# Altium schematic sheet EIT_Teensy_PSU.SchDoc
size A4
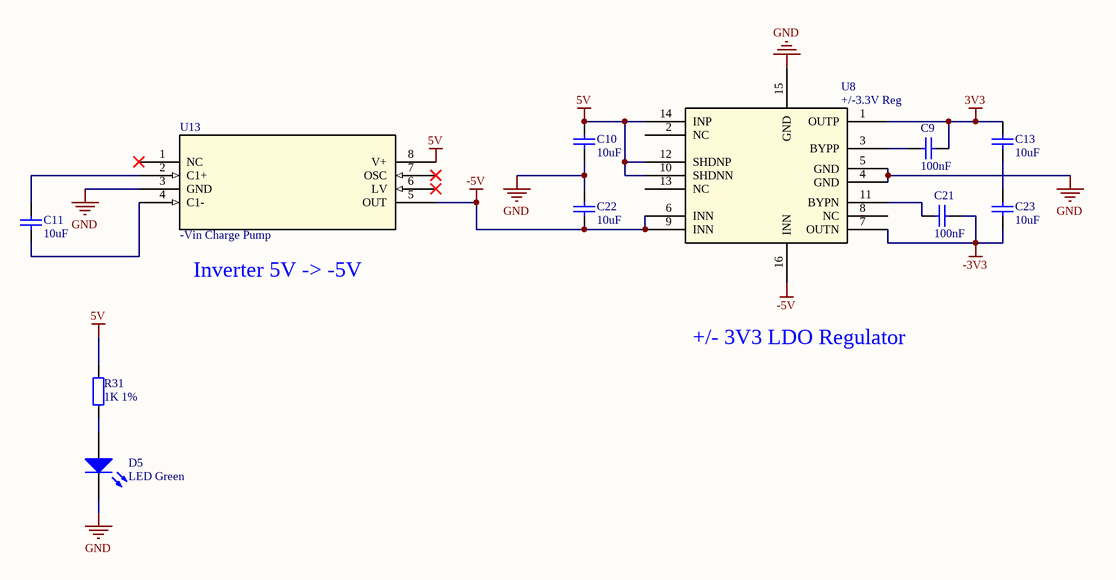
[diagram p0: EIT_Teensy_PSU.SchDoc]

## Parts
C9  100nF  [0603 CAP]
C10  10uF  [0603 CAP]
C11  10uF  [0603 CAP]
C13  10uF  [0603 CAP]
C21  100nF  [0603 CAP]
C22  10uF  [0603 CAP]
C23  10uF  [0603 CAP]
D5  LED Green  [0603 LED]
R31  1K 1%  [0603 RES]
U8  +/-3.3V Reg  [14-DFN]
U13  -Vin Charge Pump  [8-SOIC]

## Nets
3V3: C9.2 C13.2 U8.1(OUTP)
5V: C10.2 R31.1 U8.10(SHDNN) U8.12(SHDNP) U8.14(INP) U13.8(V+)
-3V3: C21.2 C23.1 U8.7(OUTN)
-5V: C22.1 U8.6(INN) U8.9(INN) U8.16(INN) U13.5(OUT)
GND: C10.1 C22.2 D5.2(K) U8.4(GND) U8.5(GND) U8.15(GND) U13.3(GND)
NetC9_1: C9.1 U8.3(BYPP)
NetC11_1: C11.1 U13.4(C1-)
NetC11_2: C11.2 U13.2(C1+)
NetC13_1: C13.1 C23.2
NetC21_1: C21.1 U8.11(BYPN)
NetD5_1: D5.1(A) R31.2

Not connected (* = marked no-connect by the designer): U8 2(NC) 8(NC) 13(NC); U13 1(NC)* 6(LV)* 7(OSC)*

## Notes on the sheet
- Inverter 5V -> -5V
- +/- 3V3 LDO Regulator

## Library data of the parts
C9 C21 = Cap 0603 100nF 10% 50V: Multi Layer Ceramic Capacitor (MLCC) / Cap Ceramic 0.1uF 50V X7R 10% Pad SMD 0603 125¡ãC T/R; Manufacturer: Samsung; Manufacturer Part Number: CL10B104KB8NNNC; Supplier 1: Digi-Key; RoHS: Yes; Category: Ceramic Capacitors; Stock 1: 16768569; Pricing 1: 1=0.10000, 10=0.03000, 50=0.01620, 100=0.01330, 500=0.00950, 1000=0.00746 (USD); Mount: Surface Mount; Case/Package: 0603; Case Code (Metric): 1608; Case Code (Imperial): 0603; Material: Ceramic; Contact Plating: Tin; Min Operating Temperature: -55°C; Max Operating Temperature: 125°C; Tolerance: 10%; Package Quantity: 1; Packaging: Tape and Reel; Capacitance: 100nF; Dielectric: X7R; Series: CL; Voltage Rating: 50V; Voltage: 50V; Voltage Rating (DC): 50V; Construction: Flat; Length: 1.6mm; Width: 0.031inch; Height: 0.8mm; Depth: 0.8mm; Thickness: 0.035inch; Radiation Hardening: No; Lead Free: Lead Free; RoHS Compliant: Yes; ComponentLink1URL: https://datasheet.ciiva.com/25803/cl10b104kb8nnnc-25803393.pdf?src-supplier=Digi-Key; ComponentLink1Description: https://datasheet.ciiva.com/25803/cl10b104kb8nnnc-25803393.pdf?src-supplier=Digi-Key; ComponentLink2URL: https://datasheet.ciiva.com/26838/getdatasheetpartid-89097-26838411.pdf?src-supplier=Verical; ComponentLink2Description: https://datasheet.ciiva.com/26838/getdatasheetpartid-89097-26838411.pdf?src-supplier=Verical; ComponentLink3URL: https://datasheet.ciiva.com/29198/456651-da-01-en-vs-kondensator-0605-29198839.pdf?src-supplier=Conrad; ComponentLink3Description: https://datasheet.ciiva.com/29198/456651-da-01-en-vs-kondensator-0605-29198839.pdf?src-supplier=Conrad; Supplier Part Number 1: 1276-1000-1-ND
C10 C11 C13 C22 C23 = Cap 0603 10uF 10% 25V: 0603 10 uF 25 V ±20 % Tolerance X5R Surface Mount Multilayer Ceramic Capacitor; Manufacturer: Murata; Manufacturer Part Number: GRT188R61E106ME13D; Voltage Rating: 25V; Tolerance: 20%; Supplier 1: Digi-Key; RoHS: No; Category: Ceramic Capacitors; Stock 1: 290939; Pricing 1: 1=0.53000, 10=0.36700, 50=0.25660, 100=0.22000, 500=0.16498, 1000=0.13932 (USD); Case/Package: 0603; RoHS Compliant: No; ComponentLink1URL: https://search.murata.co.jp/Ceramy/image/img/A01X/G101/ENG/GRT188R61E106ME13-01.pdf?src-supplier=Digi-Key; ComponentLink1Description: https://search.murata.co.jp/Ceramy/image/img/A01X/G101/ENG/GRT188R61E106ME13-01.pdf?src-supplier=Digi-Key; Supplier Part Number 1: 490-12323-1-ND; Mount: Surface Mount; Case Code (Metric): 1608; Case Code (Imperial): 0603; Min Operating Temperature: -55°C; Max Operating Temperature: 85°C; Packaging: Tape and Reel; Capacitance: 10uF; Length: 0.063inch; Width: 0.031inch; Thickness: 0.035inch; Ratings: AEC-Q200; ComponentLink2URL: http://search.murata.co.jp/Ceramy/image/img/A01X/G101/ENG/GRT188R61E106ME13-01.pdf?src-supplier=Digi-Key; ComponentLink2Description: http://search.murata.co.jp/Ceramy/image/img/A01X/G101/ENG/GRT188R61E106ME13-01.pdf?src-supplier=Digi-Key
D5 = LED Green 0603 2V: LED GREEN DIFFUSED 0603 SMD; Manufacturer: Osram Opto; Manufacturer Part Number: LG Q396-PS-35; Lens Color: White; Luminous Intensity: 163mcd; Test Current: 20mA; Viewing Angle: 120°; Dominant Wavelength: 573nm; Forward Voltage: 2V; Lens Style: Flat,Rectangular; Lens Size: 0.8mm; Supplier 1: Digi-Key; RoHS: Yes; Stock 1: 58559; Pricing 1: 1=0.38000, 10=0.20600, 100=0.09540, 500=0.08808, 1000=0.06900, 2000=0.06754 (USD); Mount: Surface Mount; Case/Package: 0603; Color: Green; Case Code (Imperial): 0603; Case Code (Metric): 1608; Packaging: Tape and Reel; Lens Transparency: Diffused; Forward Current: 20mA; Wavelength: 573nm; Length: 1.6mm; Width: 0.8mm; Height: 0.4mm; RoHS Compliant: Yes; REACH SVHC: No SVHC; ComponentLink1URL: http://www.farnell.com/datasheets/2057314.pdf?src-supplier=Farnell; ComponentLink1Description: http://www.farnell.com/datasheets/2057314.pdf?src-supplier=Farnell; ComponentLink2URL: https://dammedia.osram.info/media/resource/hires/osram-dam-2493948/LG%20Q396.pdf?src-supplier=Digi-Key; ComponentLink2Description: https://dammedia.osram.info/media/resource/hires/osram-dam-2493948/LG%20Q396.pdf?src-supplier=Digi-Key; ComponentLink3URL: http://www.osram-os.com/Graphics/XPic6/00153197_0.pdf?src-supplier=Digi-Key; ComponentLink3Description: http://www.osram-os.com/Graphics/XPic6/00153197_0.pdf?src-supplier=Digi-Key; ComponentLink4URL: http://www.farnell.com/datasheets/2057314.pdf?src-supplier=Element14; ComponentLink4Description: http://www.farnell.com/datasheets/2057314.pdf?src-supplier=Element14; ComponentLink5URL: http://www.farnell.com/datasheets/2057314.pdf?src-supplier=Newark; ComponentLink5Description: http://www.farnell.com/datasheets/2057314.pdf?src-supplier=Newark; Supplier Part Number 1: 475-3754-1-ND
R31 = Res 0603 1K 1%: RES SMD 1K OHM 1% 1/10W 0603; Manufacturer: Yageo; Manufacturer Part Number: RC0603FR-071KL; Power Rating: 100mW; Resistance: 1kR; Voltage Rating: 50V; Temperature Coefficient: 100ppm/°C; Supplier 1: Digi-Key; RoHS: Yes; Category: Chip SMD Resistors; Stock 1: 23578085; Pricing 1: 1=0.10000, 10=0.02400, 100=0.00970, 1000=0.00436, 2500=0.00378 (USD); Case/Package: 0603; Case Code (Imperial): 0603; Case Code (Metric): 1608; Size Code: 0603; Contact Plating: Tin,Matte; Min Operating Temperature: -55°C; Max Operating Temperature: 155°C; Tolerance: 1%; Packaging: Tape and Reel; Termination: SMD/SMT; Resistor Type: Thick Film; Features: Moisture Resistant; Series: RC; Max Power Dissipation: 100mW; Number of Terminations: 2; Resistance Tolerance: 1%; Construction: Rectangular; Technology: THICK FILM; Length: 1.6mm; Height: 0.45mm; Depth: 0.8mm; Radiation Hardening: No; REACH SVHC: No SVHC; Military Standard: Not; Lead Free: Lead Free; RoHS Compliant: Yes; ComponentLink1URL: https://datasheet.ciiva.com/8896/pyu-rc0603-51-rohs-l-4-8896106.pdf?src-supplier=Avnet; ComponentLink1Description: https://datasheet.ciiva.com/8896/pyu-rc0603-51-rohs-l-4-8896106.pdf?src-supplier=Avnet; Supplier Part Number 1: 311-1.00KHRCT-ND
U8 = IC Reg LDO +/-3.3V 150mA: IC REG LINEAR +-3.3V 14DFN; Manufacturer: Analog Devices / Linear Technology; Manufacturer Part Number: LT3032EDE-3.3#PBF; Output Current: 150mA; Dropout Voltage: 270mV; Number of Regulators: 2; Min Current Limit: 170mA; Output Voltage: 3.3V; Supplier 1: Digi-Key; RoHS: Yes; Category: Voltage Regulators - Linear; Stock 1: 2734; Pricing 1: 1=5.87000, 10=5.27300, 25=4.98480, 100=4.32000, 250=4.09848, 500=3.67756, 1000=3.13500 (USD); Mount: Surface Mount; Case/Package: DFN; Number of Pins: 14; Min Operating Temperature: -40°C; Max Operating Temperature: 125°C; Packaging: Rail/Tube; Number of Outputs: 2; REACH SVHC: No SVHC; RoHS Compliant: Yes; ComponentLink1URL: http://farnell.com//datasheets/2281794.pdf?src-supplier=Farnell; ComponentLink1Description: http://farnell.com//datasheets/2281794.pdf?src-supplier=Farnell; ComponentLink2URL: http://www.linear.com/docs/44087?src-supplier=Digi-Key; ComponentLink2Description: http://www.linear.com/docs/44087?src-supplier=Digi-Key; Supplier Part Number 1: LT3032EDE-3.3#PBF-ND
U13 = LMC7660IMX/NOPB: Charge Pump -Vin -10V 8-Pin SOIC T/R; Manufacturer: TI National Semiconductor; Max Input Voltage: 10V; Min Input Voltage: 1.5V; Number of Outputs: 1; Switching Frequency: 10kHz; Operating Supply Current: 200uA; Max Output Voltage: -1.5V; Logic Function: Inverting; Output Power: 600mW; Quiescent Current: 120uA; Output Current: 20uA; Output Type: Adjustable; Supplier 1: Digi-Key; Manufacturer Part Number: LMC7660IMX/NOPB; RoHS: Yes; Category: Voltage Regulators - Switching; Stock 1: 20127; Pricing 1: 1=0.87000, 10=0.78200, 25=0.74200, 100=0.56980, 250=0.50352, 500=0.47700, 1000=0.37100 (USD); Mount: Surface Mount; Case/Package: SOIC N; Number of Pins: 8; Weight: 0.006596oz; Contact Plating: Tin; Min Operating Temperature: -40°C; Max Operating Temperature: 85°C; Output Voltage: -10V; Packaging: Tape and Reel; Min Supply Voltage: 1.5V; Max Supply Voltage: 10V; Min Output Voltage: -10V; Radiation Hardening: No; REACH SVHC: No SVHC; Lead Free: Lead Free; RoHS Compliant: Yes; ComponentLink1URL: https://datasheet.ciiva.com/6598/lmc7660-6598421.pdf?src-supplier=Digi-Key; ComponentLink1Description: https://datasheet.ciiva.com/6598/lmc7660-6598421.pdf?src-supplier=Digi-Key; ComponentLink2URL: https://datasheet.ciiva.com/6598/lmc7660-6598422.pdf?src-supplier=Digi-Key; ComponentLink2Description: https://datasheet.ciiva.com/6598/lmc7660-6598422.pdf?src-supplier=Digi-Key; ComponentLink3URL: https://datasheet.ciiva.com/6598/lmc7660-6598423.pdf?src-supplier=Digi-Key; ComponentLink3Description: https://datasheet.ciiva.com/6598/lmc7660-6598423.pdf?src-supplier=Digi-Key; ComponentLink4URL: https://datasheet.ciiva.com/46433/1841924-46433674.pdf?src-supplier=Element14; ComponentLink4Description: https://datasheet.ciiva.com/46433/1841924-46433674.pdf?src-supplier=Element14; Supplier Part Number 1: LMC7660IMX/NOPBCT-ND